# EAGLE design 7segement4minidigits1badidea-mk-2 (EAGLE 6.5.0)
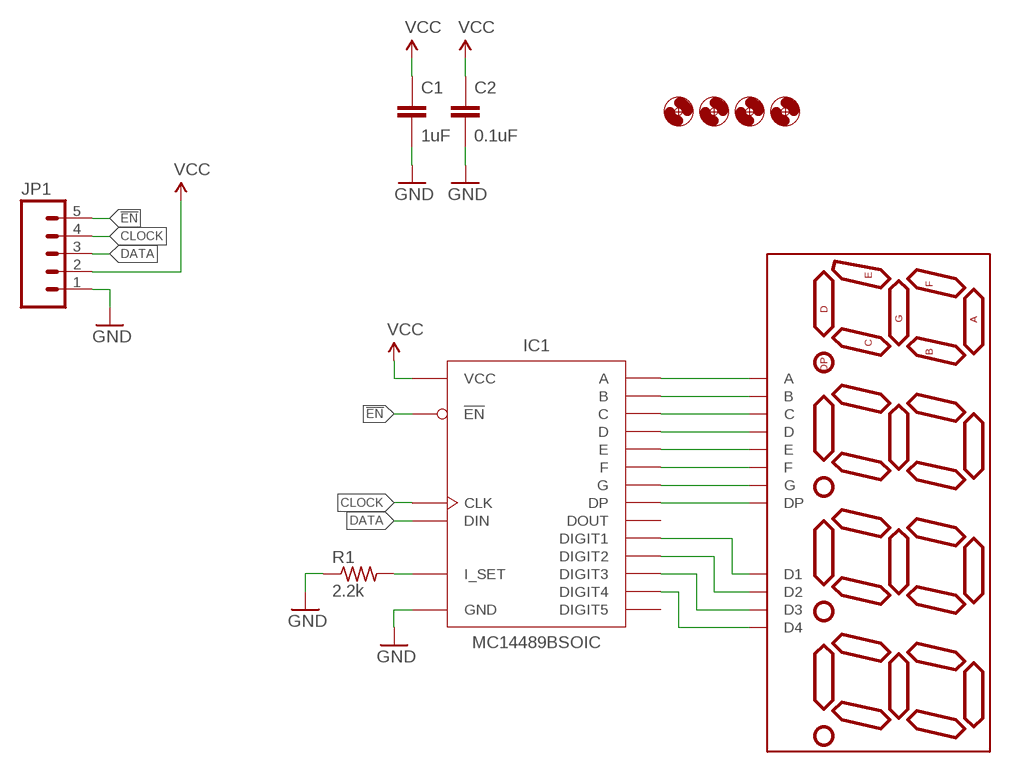
[diagram p0: schematic, sheet 1]

## Parts
BUBBLES!  (>^_^)>  7-SEGMENT-4DIGIT-COUNTERWAT  [DIP12-SMD-WAT]
C1  1uF  CAPACITOR-CERAMICC0805  [C0805]
C2  0.1uF  CAPACITOR-CERAMICC0603  [C0603]
H1  HOLE#2  [HOLE-#2]
H2  HOLE#2  [HOLE-#2]
H3  HOLE#2  [HOLE-#2]
H4  HOLE#2  [HOLE-#2]
IC1  MC14489BSOIC  [SOP20W]
JP1  M05PTH  [1X05]
R1  2.2k  RESISTORR0603  [R0603]

## Nets
!EN: IC1.10(!EN) JP1.5
CLOCK: IC1.11(CLK) JP1.4
DATA: IC1.12(DIN) JP1.3
GND: C1.2 C2.2 IC1.14(GND) JP1.1 R1.1
N$1: BUBBLES!.12(A) IC1.7(A)
N$2: BUBBLES!.11(B) IC1.6(B)
N$3: BUBBLES!.3(C) IC1.5(C)
N$4: BUBBLES!.8(D) IC1.4(D)
N$5: BUBBLES!.2(E) IC1.2(E)
N$6: BUBBLES!.9(F) IC1.1(F)
N$7: BUBBLES!.7(G) IC1.20(G)
N$8: BUBBLES!.5(DP) IC1.19(DP)
N$9: BUBBLES!.1(D1) IC1.9(DIGIT1)
N$10: BUBBLES!.10(D2) IC1.13(DIGIT2)
N$11: BUBBLES!.4(D3) IC1.15(DIGIT3)
N$12: BUBBLES!.6(D4) IC1.16(DIGIT4)
N$15: IC1.8(I_SET) R1.2
VCC: C1.1 C2.1 IC1.3(VCC) JP1.2
Unconnected: IC1.17(DIGIT5) IC1.18(DOUT)

## Library data of the parts
BUBBLES! = A_butts:7-SEGMENT-4DIGIT-COUNTER
C1 C2 = A_butts:CAPACITOR-CERAMIC: CAPACITOR, European symbol
H1-H4 = A_butts:HOLE: MOUNTING HOLE with drill center marker
IC1 = A_butts:MC14489B
JP1 = A_butts:M05: Header 5 Standard 5-pin 0.1" header. Use with straight break away headers (SKU : PRT-00116), right angle break away headers (PRT-00553), swiss pins (PRT-00743), machine pins (PRT-00117), and female headers (PRT-00115). Molex polarized connector foot print use with SKU : PRT-08230 with associated crimp pins and housings.
R1 = A_butts:RESISTOR: RESISTOR, American symbol

## Board
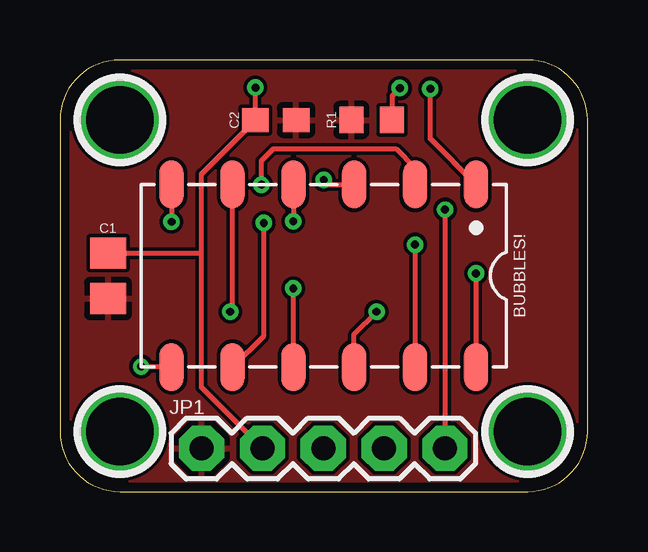
[diagram p1: board, top side]
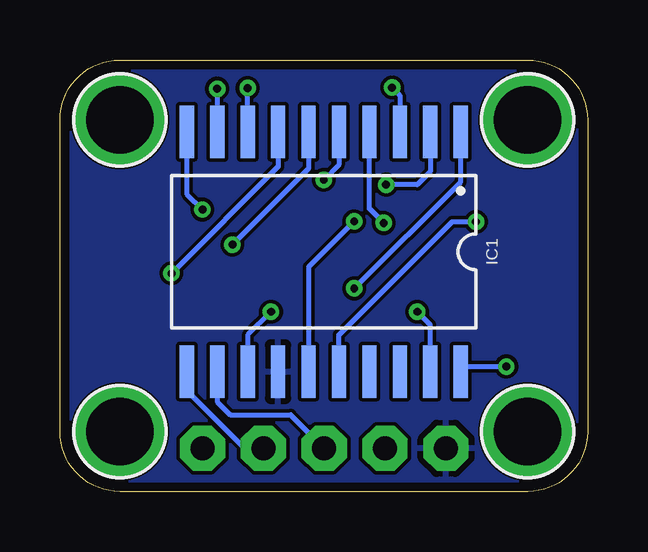
[diagram p2: board, bottom side, seen from below]

Size 22 x 18 mm. Coordinates in mm from the lower left corner, seen from the top.
Outline: 0,15.5 0,2.5 arc90 2.5,0 19.5,0 arc90 22,2.5 22,15.5 arc90 19.5,18 2.5,18 arc90 0,15.5
Copper layers (1*16): Top 0.0356mm / dielectric 1.5011mm / Bottom 0.0356mm
Design rules "LaenPCBOrder_2": minimum track width 6mil, minimum drill 13mil, track to track 6mil, track to pad 6mil, pad to pad 6mil, via to via 6mil, smd to smd 6mil, copper to edge 15mil, drill to drill 6mil, minimum pad ring 7mil, minimum via ring 7mil, stop-mask expansion 3mil, vias tented up to drill 20mil, thermal gap 10mil

### Footprints (pad centres in the part's own frame; a part is rotated, then mirrored left to right if it is on the bottom)
DIP12-SMD-WAT = smd 1 x 2: 1 -6.35,-3.81; 2 -3.81,-3.81; 3 -1.27,-3.81; 4 1.27,-3.81; 5 3.81,-3.81; 6 6.35,-3.81; 7 6.35,3.81; 8 3.81,3.81; 9 1.27,3.81; 10 -1.27,3.81; 11 -3.81,3.81; 12 -6.35,3.81
C0805 = smd 1.3 x 1.5: 1 -0.95,0; 2 0.95,0
C0603 = smd 1.1 x 1: 1 -0.85,0; 2 0.85,0
HOLE-#2 = drill 2.8 pad 3.81: P$1 0,0
SOP20W = smd 0.6 x 2.2: 1 -5.715,-5; 2 -4.445,-5; 3 -3.175,-5; 4 -1.905,-5; 5 -0.635,-5; 6 0.635,-5; 7 1.905,-5; 8 3.175,-5; 9 4.445,-5; 10 5.715,-5; 11 5.715,5; 12 4.445,5; 13 3.175,5; 14 1.905,5; 15 0.635,5; 16 -0.635,5; 17 -1.905,5; 18 -3.175,5; 19 -4.445,5; 20 -5.715,5
1X05 = drill 1 pad 1.88 octagon: 1 0,0; 2 2.54,0; 3 5.08,0; 4 7.62,0; 5 10.16,0
R0603 = smd 1 x 1.1: 1 -0.85,0; 2 0.85,0

### Placement (x,y rotation side)
BUBBLES!  11,9 180 top
C1  2,9 270 top
C2  9,15.5 0 top
H1  2.5,2.5 0 top
H2  2.5,15.5 0 top
H3  19.5,2.5 0 top
H4  19.5,15.5 0 top
IC1  11,10 180 bottom
JP1  5.9,1.8 0 top
R1  13,15.5 0 top

### Tracks (layer width: path | path; a pad name or v marks a point on that pad's centre or on a via)
!EN  (via drill 0.33)
  Top 0.2: v16.06,11.76 JP1.5
  Bottom 0.2: IC1.10 16.71,12.41 v16.06,11.76
CLOCK
  Bottom 0.2: IC1.11 16.71,4.21 14.3,1.8 JP1.4
DATA
  Bottom 0.2: IC1.12 15.45,3.75 14.9,3.2 12.38,3.2 JP1.3
GND
  pour Top: 19.5,0 2.5,0 arc-90 0,2.5 0,15.5 arc-90 2.5,18 19.5,18 arc-90 22,15.5 22,2.5 arc-90
  pour Bottom: 19.5,0 2.5,0 arc-90 0,2.5 0,15.5 arc-90 2.5,18 19.5,18 arc-90 22,15.5 22,2.5 arc-90
N$1  (via drill 0.33)
  Top 0.2: v17.35,9.1 BUBBLES!.12
  Bottom 0.2: IC1.7 12.9,13.54 v17.35,9.1
N$2  (via drill 0.33)
  Top 0.2: v14.81,10.3 BUBBLES!.11
  Bottom 0.2: IC1.6 11.64,13.46 v14.81,10.3
N$3  (via drill 0.33)
  Top 0.2: v11,13 11.19,12.81 BUBBLES!.3
  Bottom 0.2: IC1.5 10.37,13.63 v11,13
N$4  (via drill 0.33)
  Top 0.2: BUBBLES!.8 8.5,6.5 v8.5,11.2
  Bottom 0.2: v8.5,11.2 9.1,11.79 IC1.4
N$5  (via drill 0.33)
  Top 0.2: v8.4,12.8 8.4,13.8 8.9,14.3 14,14.3 14.81,13.49 BUBBLES!.2
  Bottom 0.2: IC1.2 6.55,13.35 7.1,12.8 v8.4,12.8
N$6  (via drill 0.33)
  Top 0.2: BUBBLES!.9 v9.73,8.47
  Bottom 0.2: v9.73,8.47 5.29,12.91 IC1.1
N$7  (via drill 0.33)
  Top 0.2: v3.38,5.21 4.62,5.21 BUBBLES!.7
  Bottom 0.2: IC1.20 5.07,5.21 v3.38,5.21
N$8  (via drill 0.33)
  Top 0.2: v7.1,7.5 7.19,7.59 BUBBLES!.5
  Bottom 0.2: IC1.19 6.55,6.96 v7.1,7.5
N$9  (via drill 0.33)
  Top 0.2: BUBBLES!.1 15.45,14.71 v15.45,16.8
  Bottom 0.2: v15.45,16.8 IC1.9
N$10  (via drill 0.33)
  Top 0.2: BUBBLES!.10 12.27,6.57 v13.2,7.5
  Bottom 0.2: v13.2,7.5 14.18,6.53 IC1.13
N$11  (via drill 0.33)
  Top 0.2: BUBBLES!.4 v9.73,11.27
  Bottom 0.2: v9.73,11.27 11.63,9.37 IC1.15
N$12  (via drill 0.33)
  Top 0.2: BUBBLES!.6 v4.65,11.25
  Bottom 0.2: IC1.16 10.37,6.54 5.65,11.25 v4.65,11.25
N$15  (via drill 0.33)
  Top 0.2: v14.18,16.82 13.85,16.5 R1.2
  Bottom 0.2: IC1.8 v14.18,16.82
VCC  (via drill 0.33)
  Top 0.2: JP1.2 5.9,4.34 5.9,10 | 5.9,10 5.9,13.25 C2.1 v8.15,16.85 | C1.1 5.85,9.95 5.9,10
  Bottom 0.2: v8.15,16.85 7.83,16.52 IC1.3